# Altium project node24.PrjPcb (part 4 of 5)

## Sheet node24-bank.SchDoc: Output Channel
size Tabloid; Author: Emergence Team; Engineer: asheem; Organization: Emergence; Address1: Oakland, California; Address2: a@aliengeometry.com; Address3: Black Rock City '18; Address4: OPEN SOURCE H/W; DocumentNumber: 3; Revision: Rev 0.1; SheetNumber: 3; SheetTotal: 6; Project: NODE24
Used 3 times, as channels U_BANK-A, U_BANK-B, U_BANK-C. Parts and nets are listed once, with the designators drawn on the sheet.
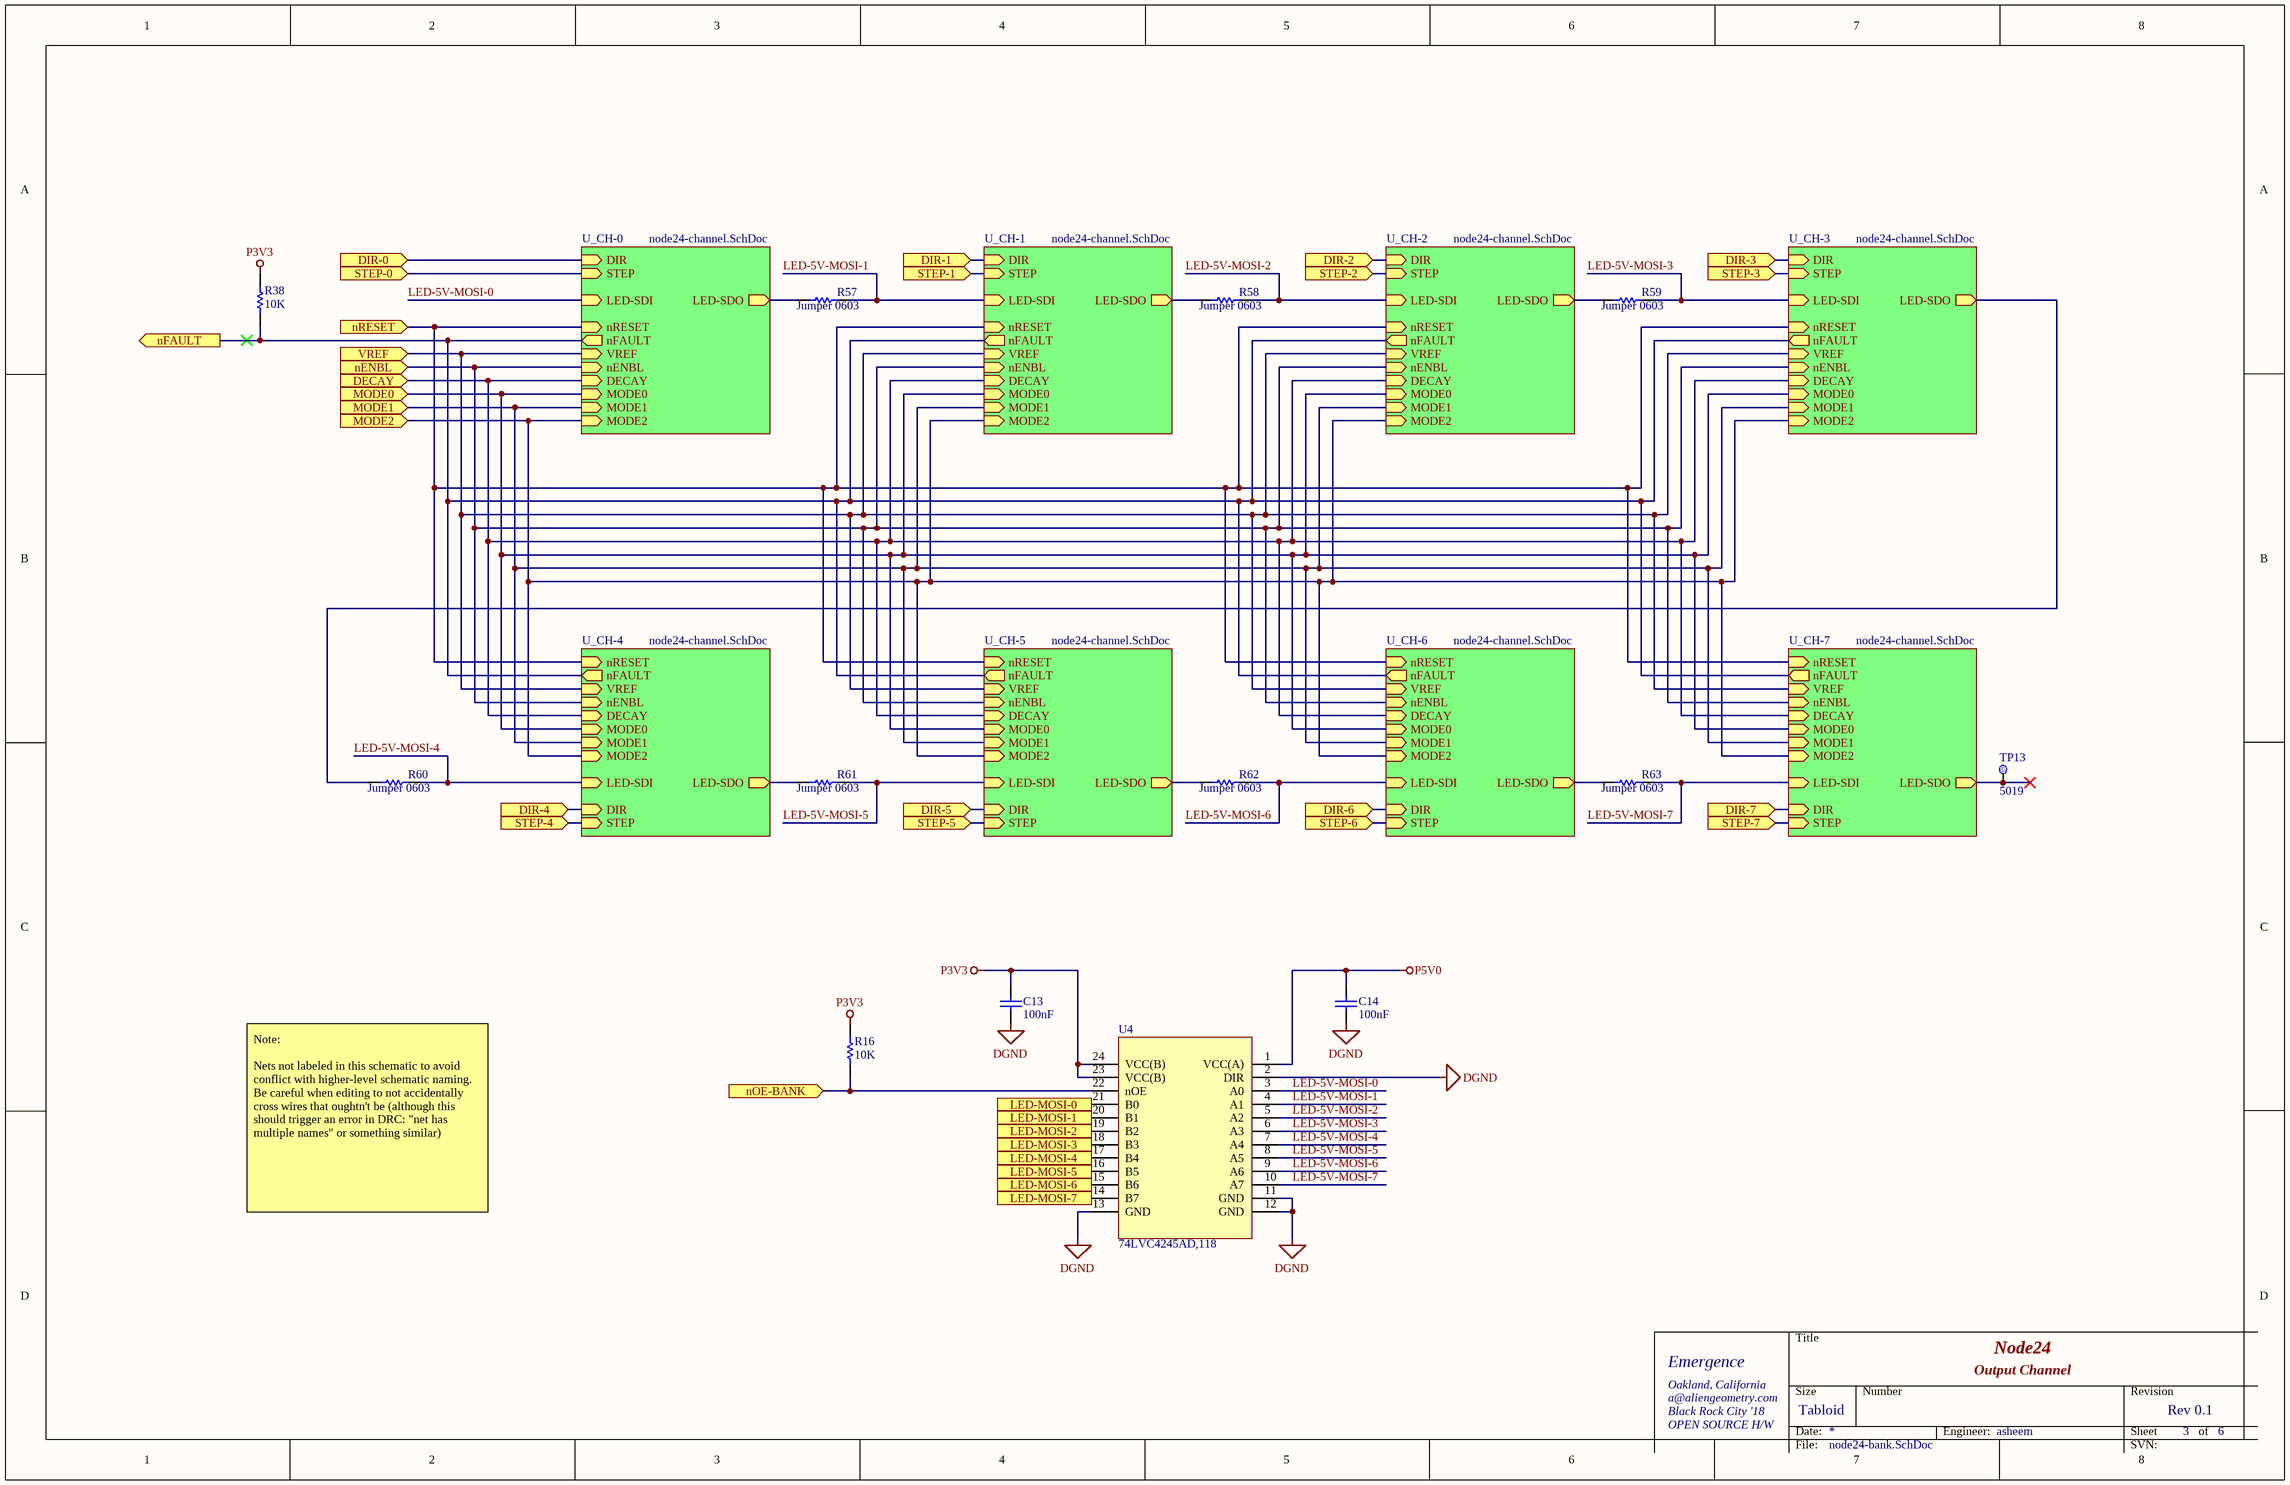
[diagram p4: node24-bank.SchDoc]

### Parts
C13  100nF  [CAPC0603(1608)100_L]
C14  100nF  [CAPC0603(1608)100_L]
R16  10K  [RESC0603(1608)_L]
R38  10K  [RESC0603(1608)_L]
R57  Jumper 0603  [RESC0603(1608)_L]
R58  Jumper 0603  [RESC0603(1608)_L]
R59  Jumper 0603  [RESC0603(1608)_L]
R60  Jumper 0603  [RESC0603(1608)_L]
R61  Jumper 0603  [RESC0603(1608)_L]
R62  Jumper 0603  [RESC0603(1608)_L]
R63  Jumper 0603  [RESC0603(1608)_L]
TP13  Manufacturer Part Number: 5019  [TEST_POINT_KEYSTONE_5019]  (hidden comment: TEST_POINT_KEYSTONE_5019_SMT)
U4  74LVC4245AD,118  [IC_TSSOP-24]

### Sub-sheets
U_CH-0 = node24-channel.SchDoc: VREF (in), nENBL (in), STEP (in), DIR (in), DECAY (in), MODE0 (in), MODE1 (in), MODE2 (in), nRESET (in), nFAULT (out), LED-SDI (in), LED-SDO (out)
U_CH-1 = node24-channel.SchDoc: VREF (in), nENBL (in), STEP (in), DIR (in), DECAY (in), MODE0 (in), MODE1 (in), MODE2 (in), nRESET (in), nFAULT (out), LED-SDI (in), LED-SDO (out)
U_CH-2 = node24-channel.SchDoc: VREF (in), nENBL (in), STEP (in), DIR (in), DECAY (in), MODE0 (in), MODE1 (in), MODE2 (in), nRESET (in), nFAULT (out), LED-SDI (in), LED-SDO (out)
U_CH-3 = node24-channel.SchDoc: VREF (in), nENBL (in), STEP (in), DIR (in), DECAY (in), MODE0 (in), MODE1 (in), MODE2 (in), nRESET (in), nFAULT (out), LED-SDI (in), LED-SDO (out)
U_CH-4 = node24-channel.SchDoc: VREF (in), nENBL (in), STEP (in), DIR (in), DECAY (in), MODE0 (in), MODE1 (in), MODE2 (in), nRESET (in), LED-SDI (in), LED-SDO (out), nFAULT (out)
U_CH-5 = node24-channel.SchDoc: VREF (in), nENBL (in), STEP (in), DIR (in), DECAY (in), MODE0 (in), MODE1 (in), MODE2 (in), nRESET (in), LED-SDI (in), LED-SDO (out), nFAULT (out)
U_CH-6 = node24-channel.SchDoc: VREF (in), nENBL (in), STEP (in), DIR (in), DECAY (in), MODE0 (in), MODE1 (in), MODE2 (in), nRESET (in), LED-SDI (in), LED-SDO (out), nFAULT (out)
U_CH-7 = node24-channel.SchDoc: VREF (in), nENBL (in), STEP (in), DIR (in), DECAY (in), MODE0 (in), MODE1 (in), MODE2 (in), nRESET (in), LED-SDI (in), LED-SDO (out), nFAULT (out)

### Ports
DECAY (in), DIR-0 (in), DIR-1 (in), DIR-2 (in), DIR-3 (in), DIR-4 (in), DIR-5 (in), DIR-6 (in), DIR-7 (in), LED-MOSI-0 (in), LED-MOSI-1 (in), LED-MOSI-2 (in), LED-MOSI-3 (in), LED-MOSI-4 (in), LED-MOSI-5 (in), LED-MOSI-6 (in), LED-MOSI-7 (in), MODE0 (in), MODE1 (in), MODE2 (in), nENBL (in), nFAULT (out), nOE-BANK (in), nRESET (in), STEP-0 (in), STEP-1 (in), STEP-2 (in), STEP-3 (in), STEP-4 (in), STEP-5 (in), STEP-6 (in), STEP-7 (in), VREF (in)

### Nets
DGND: C13.2 C14.2 U4.2(DIR) U4.11(GND) U4.12(GND) U4.13(GND)
P3V3: C13.1 R16.2 R38.2 U4.23(VCC(B)) U4.24(VCC(B))
P5V0: C14.1 U4.1(VCC(A))
DECAY: port DECAY, sheet U_CH-0/DECAY, sheet U_CH-4/DECAY, sheet U_CH-1/DECAY, sheet U_CH-5/DECAY, sheet U_CH-2/DECAY, sheet U_CH-6/DECAY, sheet U_CH-3/DECAY, sheet U_CH-7/DECAY
DIR-0: port DIR-0, sheet U_CH-0/DIR
DIR-1: port DIR-1, sheet U_CH-1/DIR
DIR-2: port DIR-2, sheet U_CH-2/DIR
DIR-3: port DIR-3, sheet U_CH-3/DIR
DIR-4: port DIR-4, sheet U_CH-4/DIR
DIR-5: port DIR-5, sheet U_CH-5/DIR
DIR-6: port DIR-6, sheet U_CH-6/DIR
DIR-7: port DIR-7, sheet U_CH-7/DIR
LED-5V-MOSI-0: U4.3(A0) ; sheet U_CH-0/LED-SDI
LED-5V-MOSI-1: R57.2 U4.4(A1) ; sheet U_CH-1/LED-SDI
LED-5V-MOSI-2: R58.2 U4.5(A2) ; sheet U_CH-2/LED-SDI
LED-5V-MOSI-3: R59.2 U4.6(A3) ; sheet U_CH-3/LED-SDI
LED-5V-MOSI-4: R60.2 U4.7(A4) ; sheet U_CH-4/LED-SDI
LED-5V-MOSI-5: R61.2 U4.8(A5) ; sheet U_CH-5/LED-SDI
LED-5V-MOSI-6: R62.2 U4.9(A6) ; sheet U_CH-6/LED-SDI
LED-5V-MOSI-7: R63.2 U4.10(A7) ; sheet U_CH-7/LED-SDI
LED-MOSI-0: U4.21(B0) ; port LED-MOSI-0
LED-MOSI-1: U4.20(B1) ; port LED-MOSI-1
LED-MOSI-2: U4.19(B2) ; port LED-MOSI-2
LED-MOSI-3: U4.18(B3) ; port LED-MOSI-3
LED-MOSI-4: U4.17(B4) ; port LED-MOSI-4
LED-MOSI-5: U4.16(B5) ; port LED-MOSI-5
LED-MOSI-6: U4.15(B6) ; port LED-MOSI-6
LED-MOSI-7: U4.14(B7) ; port LED-MOSI-7
MODE0: port MODE0, sheet U_CH-0/MODE0, sheet U_CH-4/MODE0, sheet U_CH-1/MODE0, sheet U_CH-5/MODE0, sheet U_CH-2/MODE0, sheet U_CH-6/MODE0, sheet U_CH-3/MODE0, sheet U_CH-7/MODE0
MODE1: port MODE1, sheet U_CH-0/MODE1, sheet U_CH-4/MODE1, sheet U_CH-1/MODE1, sheet U_CH-5/MODE1, sheet U_CH-2/MODE1, sheet U_CH-6/MODE1, sheet U_CH-3/MODE1, sheet U_CH-7/MODE1
MODE2: port MODE2, sheet U_CH-0/MODE2, sheet U_CH-4/MODE2, sheet U_CH-1/MODE2, sheet U_CH-5/MODE2, sheet U_CH-2/MODE2, sheet U_CH-6/MODE2, sheet U_CH-3/MODE2, sheet U_CH-7/MODE2
nENBL: port nENBL, sheet U_CH-0/nENBL, sheet U_CH-4/nENBL, sheet U_CH-1/nENBL, sheet U_CH-5/nENBL, sheet U_CH-2/nENBL, sheet U_CH-6/nENBL, sheet U_CH-3/nENBL, sheet U_CH-7/nENBL
nFAULT: R38.1 ; port nFAULT, sheet U_CH-0/nFAULT, sheet U_CH-4/nFAULT, sheet U_CH-1/nFAULT, sheet U_CH-5/nFAULT, sheet U_CH-2/nFAULT, sheet U_CH-6/nFAULT, sheet U_CH-3/nFAULT, sheet U_CH-7/nFAULT
nOE-BANK: R16.1 U4.22(nOE) ; port nOE-BANK
nRESET: port nRESET, sheet U_CH-0/nRESET, sheet U_CH-4/nRESET, sheet U_CH-1/nRESET, sheet U_CH-5/nRESET, sheet U_CH-2/nRESET, sheet U_CH-6/nRESET, sheet U_CH-3/nRESET, sheet U_CH-7/nRESET
STEP-0: port STEP-0, sheet U_CH-0/STEP
STEP-1: port STEP-1, sheet U_CH-1/STEP
STEP-2: port STEP-2, sheet U_CH-2/STEP
STEP-3: port STEP-3, sheet U_CH-3/STEP
STEP-4: port STEP-4, sheet U_CH-4/STEP
STEP-5: port STEP-5, sheet U_CH-5/STEP
STEP-6: port STEP-6, sheet U_CH-6/STEP
STEP-7: port STEP-7, sheet U_CH-7/STEP
VREF: port VREF, sheet U_CH-0/VREF, sheet U_CH-4/VREF, sheet U_CH-1/VREF, sheet U_CH-5/VREF, sheet U_CH-2/VREF, sheet U_CH-6/VREF, sheet U_CH-3/VREF, sheet U_CH-7/VREF
NetR57_1: R57.1 ; sheet U_CH-0/LED-SDO
NetR58_1: R58.1 ; sheet U_CH-1/LED-SDO
NetR59_1: R59.1 ; sheet U_CH-2/LED-SDO
NetR60_1: R60.1 ; sheet U_CH-3/LED-SDO
NetR61_1: R61.1 ; sheet U_CH-4/LED-SDO
NetR62_1: R62.1 ; sheet U_CH-5/LED-SDO
NetR63_1: R63.1 ; sheet U_CH-6/LED-SDO
NetTP13_1: TP13.1 ; sheet U_CH-7/LED-SDO

### Channels
U_BANK-A: designators end in A; ports DECAY=DRV-BANKA-DECAY DIR-0=DRV-BANKA-DIR-0 DIR-1=DRV-BANKA-DIR-1 DIR-2=DRV-BANKA-DIR-2 DIR-3=DRV-BANKA-DIR-3 DIR-4=DRV-BANKA-DIR-4 DIR-5=DRV-BANKA-DIR-5 DIR-6=DRV-BANKA-DIR-6 DIR-7=DRV-BANKA-DIR-7 LED-MOSI-0=LED-BANKA-MOSI-0 LED-MOSI-1=LED-BANKA-MOSI-1 LED-MOSI-2=LED-BANKA-MOSI-2 LED-MOSI-3=LED-BANKA-MOSI-3 LED-MOSI-4=LED-BANKA-MOSI-4 LED-MOSI-5=LED-BANKA-MOSI-5 LED-MOSI-6=LED-BANKA-MOSI-6 LED-MOSI-7=LED-BANKA-MOSI-7 MODE0=DRV-BANKA-MODE0 MODE1=DRV-BANKA-MODE1 MODE2=DRV-BANKA-MODE2 nENBL=DRV-BANKA-nENBL nFAULT=DRV-BANKA-nFAULT nOE-BANK=LED-BANKA-nOE nRESET=DRV-BANKA-nRESET STEP-0=DRV-BANKA-STEP-0 STEP-1=DRV-BANKA-STEP-1 STEP-2=DRV-BANKA-STEP-2 STEP-3=DRV-BANKA-STEP-3 STEP-4=DRV-BANKA-STEP-4 STEP-5=DRV-BANKA-STEP-5 STEP-6=DRV-BANKA-STEP-6 STEP-7=DRV-BANKA-STEP-7 VREF=DRV-BANKA-VREF
U_BANK-B: designators end in B; ports DECAY=DRV-BANKB-DECAY DIR-0=DRV-BANKB-DIR-0 DIR-1=DRV-BANKB-DIR-1 DIR-2=DRV-BANKB-DIR-2 DIR-3=DRV-BANKB-DIR-3 DIR-4=DRV-BANKB-DIR-4 DIR-5=DRV-BANKB-DIR-5 DIR-6=DRV-BANKB-DIR-6 DIR-7=DRV-BANKB-DIR-7 LED-MOSI-0=LED-BANKB-MOSI-0 LED-MOSI-1=LED-BANKB-MOSI-1 LED-MOSI-2=LED-BANKB-MOSI-2 LED-MOSI-3=LED-BANKB-MOSI-3 LED-MOSI-4=LED-BANKB-MOSI-4 LED-MOSI-5=LED-BANKB-MOSI-5 LED-MOSI-6=LED-BANKB-MOSI-6 LED-MOSI-7=LED-BANKB-MOSI-7 MODE0=DRV-BANKB-MODE0 MODE1=DRV-BANKB-MODE1 MODE2=DRV-BANKB-MODE2 nENBL=DRV-BANKB-nENBL nFAULT=DRV-BANKB-nFAULT nOE-BANK=LED-BANKB-nOE nRESET=DRV-BANKB-nRESET STEP-0=DRV-BANKB-STEP-0 STEP-1=DRV-BANKB-STEP-1 STEP-2=DRV-BANKB-STEP-2 STEP-3=DRV-BANKB-STEP-3 STEP-4=DRV-BANKB-STEP-4 STEP-5=DRV-BANKB-STEP-5 STEP-6=DRV-BANKB-STEP-6 STEP-7=DRV-BANKB-STEP-7 VREF=DRV-BANKB-VREF
U_BANK-C: designators end in C; ports DECAY=DRV-BANKC-DECAY DIR-0=DRV-BANKC-DIR-0 DIR-1=DRV-BANKC-DIR-1 DIR-2=DRV-BANKC-DIR-2 DIR-3=DRV-BANKC-DIR-3 DIR-4=DRV-BANKC-DIR-4 DIR-5=DRV-BANKC-DIR-5 DIR-6=DRV-BANKC-DIR-6 DIR-7=DRV-BANKC-DIR-7 LED-MOSI-0=LED-BANKC-MOSI-0 LED-MOSI-1=LED-BANKC-MOSI-1 LED-MOSI-2=LED-BANKC-MOSI-2 LED-MOSI-3=LED-BANKC-MOSI-3 LED-MOSI-4=LED-BANKC-MOSI-4 LED-MOSI-5=LED-BANKC-MOSI-5 LED-MOSI-6=LED-BANKC-MOSI-6 LED-MOSI-7=LED-BANKC-MOSI-7 MODE0=DRV-BANKC-MODE0 MODE1=DRV-BANKC-MODE1 MODE2=DRV-BANKC-MODE2 nENBL=DRV-BANKC-nENBL nFAULT=DRV-BANKC-nFAULT nOE-BANK=LED-BANKC-nOE nRESET=DRV-BANKC-nRESET STEP-0=DRV-BANKC-STEP-0 STEP-1=DRV-BANKC-STEP-1 STEP-2=DRV-BANKC-STEP-2 STEP-3=DRV-BANKC-STEP-3 STEP-4=DRV-BANKC-STEP-4 STEP-5=DRV-BANKC-STEP-5 STEP-6=DRV-BANKC-STEP-6 STEP-7=DRV-BANKC-STEP-7 VREF=DRV-BANKC-VREF

### Notes on the sheet
- Note:
  Nets not labeled in this schematic to avoid conflict with higher-level schematic naming. Be careful when editing to not accidentally cross wires that oughtn't be (although this should trigger an error in DRC: "net has multiple names" or something similar)
- Title
- Size
- Date:
- Tabloid
- Number
- Engineer:
- Revision
- Sheet
- of
- File:
- SVN:

### Library data of the parts
C13 C14 = CMP-1035-02593-1: CAP 100nF 50V ±20% 0603 (1608 Metric) Thickness 1mm SMD; Tolerance: Â±20%; Case-EIA: 0603; Case-Metric: 1608; Max Thickness: 1 mm; Value: 100nF; Technology: SMT; Rated Voltage: 50 V
R16 R38 = CMP-1012-00623-1: 10K 0.1W 1% 0603 (1608 Metric)  SMD; Value: 10000.00 Ohm; Case-EIA: 0603; Case-Metric: 1608; Power: 0.1 W; Tolerance: 1 %; Technology: SMT
R57-R63 = CMP-1012-00001-1: Jumper 0603 (1608 Metric); Case-Metric: 1608; Value: 0.00 Ohm; Power: None; Case-EIA: 0603; Technology: SMT; Tolerance: None
TP13 = TEST_POINT_KEYSTONE_5019_SMT: Circuit Board Hardware - PCB TEST POINT; Manufacturer: Keystone Electronics; Supplier 1: Digi-Key; Stock 1: 207442; Pricing 1: 1=0.38, 10=0.355, 25=0.3044, 50=0.2586, 100=0.2485, 250=0.22316, 500=0.21302 (USD); Mount: Surface Mount,PCB; Number of Pins: 1; Contact Plating: Silver; Material: Bronze; Contact Material: Bronze; Packaging: Tape and Reel; Package Quantity: 1; Termination: SMD/SMT; Height: 0.09inch; REACH SVHC: No SVHC; Lead Free: Lead Free; ComponentLink1URL: https://datasheet.ciiva.com/14848/m60-2p61-14848437.pdf; ComponentLink1Description: https://datasheet.ciiva.com/14848/m60-2p61-14848437.pdf; ComponentLink2URL: https://datasheet.ciiva.com/14848/m60-2p61-14848438.pdf; ComponentLink2Description: https://datasheet.ciiva.com/14848/m60-2p61-14848438.pdf; ComponentLink3URL: https://datasheet.ciiva.com/14848/m60-2p61-14848439.pdf; ComponentLink3Description: https://datasheet.ciiva.com/14848/m60-2p61-14848439.pdf; ComponentLink4URL: https://datasheet.ciiva.com/16885/70182998-16885945.pdf; ComponentLink4Description: https://datasheet.ciiva.com/16885/70182998-16885945.pdf; ComponentLink5URL: https://datasheet.ciiva.com/16318/m60-2p61-16318395.pdf; ComponentLink5Description: https://datasheet.ciiva.com/16318/m60-2p61-16318395.pdf; Supplier Part Number 1: 36-5019CT-ND
U4 = 74LVC4245AD,118: IC TRANSCVR TRI-ST DL 24SOIC; Manufacturer: NXP Semiconductors; Number of Channels: 8; Propagation Delay: 8ns; Min Supply Voltage: 1.5V; Max Supply Voltage: 5.5V; Number of Elements: 1; Direction: Bidirectional; Logic Function: Transceiver,Translator; Low Level Output Current: 24mA; Turn-On Delay Time: 3.6ns; Polarity: Non-Inverting; High Level Output Current: -24mA; Quiescent Current: 100nA; Output Type: TTL; Supplier 1: Digi-Key; Stock 1: 3472; Pricing 1: 1=0.63, 10=0.558, 100=0.4277, 500=0.3381 (USD); Mount: Surface Mount; Case/Package: SO; Number of Pins: 24; Contact Plating: Gold; Min Operating Temperature: -40°C; Max Operating Temperature: 125°C; Package Quantity: 1000; Packaging: Tape and Reel; Number of Bits: 8; Number of Circuits: 1; Radiation Hardening: No; REACH SVHC: No SVHC; Lead Free: Lead Free; ComponentLink1URL: https://datasheet.ciiva.com/1899/74lvc4245a-1899059.pdf; ComponentLink1Description: https://datasheet.ciiva.com/1899/74lvc4245a-1899059.pdf; ComponentLink2URL: https://datasheet.ciiva.com/1899/74lvc4245a-1899060.pdf; ComponentLink2Description: https://datasheet.ciiva.com/1899/74lvc4245a-1899060.pdf; ComponentLink3URL: https://datasheet.ciiva.com/1899/74lvc4245a-1899061.pdf; ComponentLink3Description: https://datasheet.ciiva.com/1899/74lvc4245a-1899061.pdf; ComponentLink4URL: https://datasheet.ciiva.com/8260/74lvc4245a-8260005.pdf; ComponentLink4Description: https://datasheet.ciiva.com/8260/74lvc4245a-8260005.pdf; ComponentLink5URL: https://datasheet.ciiva.com/16591/74lvc4245a-16591349.pdf; ComponentLink5Description: https://datasheet.ciiva.com/16591/74lvc4245a-16591349.pdf; ComponentLink6URL: https://datasheet.ciiva.com/46434/1714648-46434213.pdf; ComponentLink6Description: https://datasheet.ciiva.com/46434/1714648-46434213.pdf; ComponentLink7URL: https://datasheet.ciiva.com/1899/74lvc4245a-1899063.pdf; ComponentLink7Description: https://datasheet.ciiva.com/1899/74lvc4245a-1899063.pdf; Supplier Part Number 1: 1727-6369-6-ND; Manufacturer Part Number: 74LVC4245AD,118

## Sheet node24-channel.SchDoc: Output Channel
size Tabloid; Author: Emergence Team; Engineer: asheem; Organization: Emergence; Address1: Oakland, California; Address2: a@aliengeometry.com; Address3: Black Rock City '18; Address4: OPEN SOURCE H/W; DocumentNumber: 4; Revision: Rev 0.1; SheetNumber: 4; SheetTotal: 6; Project: NODE24
Used 24 times, as channels U_BANK-A/U_CH-0, U_BANK-A/U_CH-4, U_BANK-A/U_CH-1, U_BANK-A/U_CH-5, U_BANK-A/U_CH-2, U_BANK-A/U_CH-6, U_BANK-A/U_CH-3, U_BANK-A/U_CH-7, U_BANK-B/U_CH-0, U_BANK-B/U_CH-4, U_BANK-B/U_CH-1, U_BANK-B/U_CH-5, U_BANK-B/U_CH-2, U_BANK-B/U_CH-6, U_BANK-B/U_CH-3, U_BANK-B/U_CH-7, U_BANK-C/U_CH-0, U_BANK-C/U_CH-4, U_BANK-C/U_CH-1, U_BANK-C/U_CH-5, U_BANK-C/U_CH-2, U_BANK-C/U_CH-6, U_BANK-C/U_CH-3, U_BANK-C/U_CH-7. Parts and nets are listed once, with the designators drawn on the sheet.
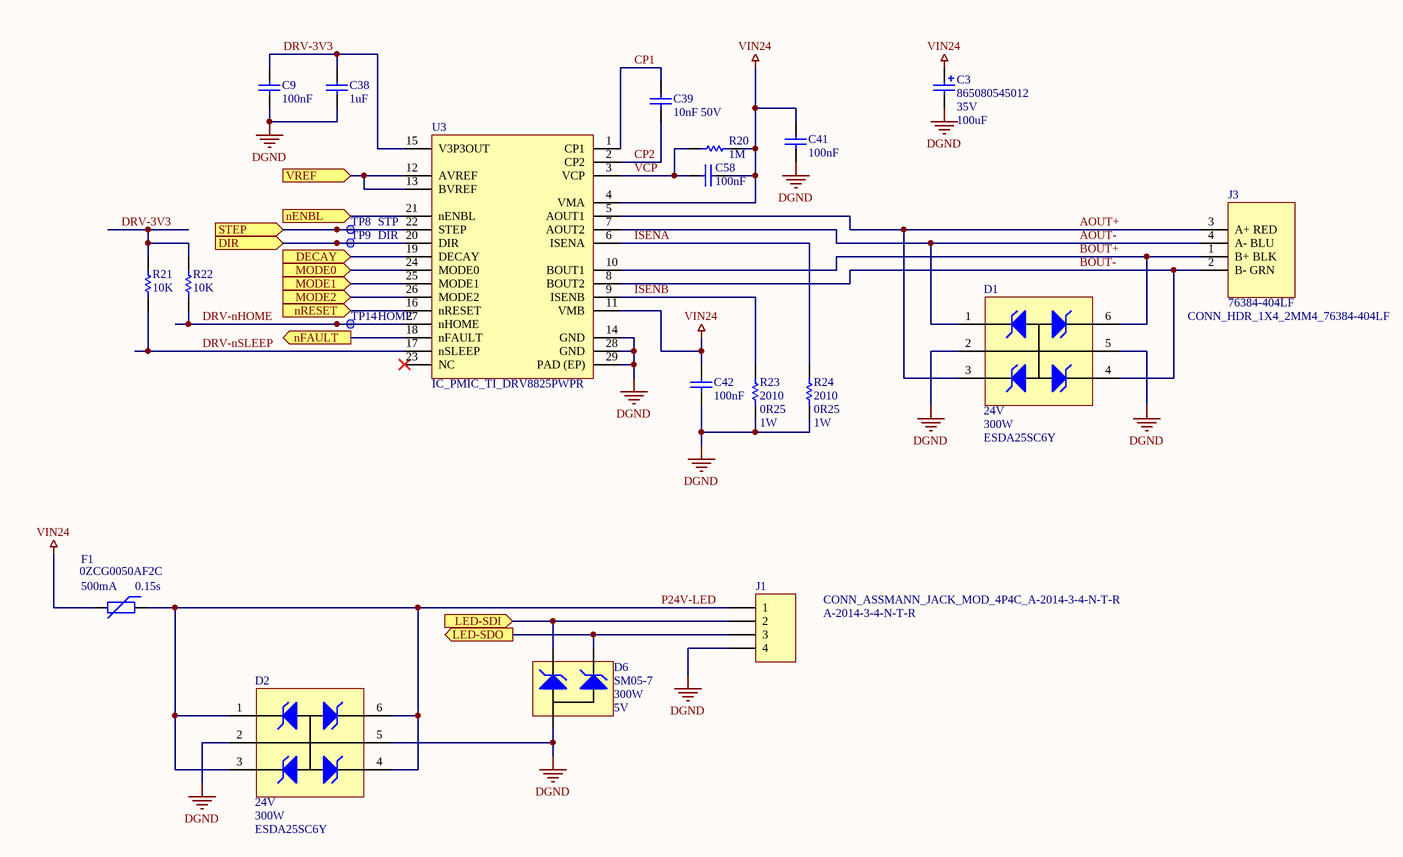
[diagram p5: node24-channel.SchDoc]

### Parts
C3  Manufacturer Part Number: 865080545012  Voltage Rating (DC): 35V  Capacitance: 100uF  [CAPAE_D6MM3]  (hidden comment: CAP_ALUM_100UF_35V_6MM3_SMT_865080545012)
C9  100nF  [CAPC0603(1608)100_L]
C38  1uF  [CAPC0603(1608)100_L]
C39  10nF 50V  [CAPC0603(1608)100_L]
C41  100nF  [CAPC0603(1608)100_L]
C42  100nF  [CAPC0603(1608)100_L]
C58  100nF  [CAPC0603(1608)100_L]
D1  Operating Supply Voltage: 24V  Peak Pulse Power: 300W  Manufacturer Part Number: ESDA25SC6Y  [SOT23-6L]  (hidden comment: TVS_24V_QUAD_300W_SOT23-6_ESDA25SC6Y)
D2  Operating Supply Voltage: 24V  Peak Pulse Power: 300W  Manufacturer Part Number: ESDA25SC6Y  [SOT23-6L]  (hidden comment: TVS_24V_QUAD_300W_SOT23-6_ESDA25SC6Y)
D6  Manufacturer Part Number: SM05-7  Max Power Dissipation: 300W  Reverse Standoff Voltage: 5V  [SOT-23]  (hidden comment: TVS_5V_DUAL_SOT23-3_SM05-7)
F1  Hold Current: 500mA  Time to Trip: 0.15s  Manufacturer Part Number: 0ZCG0050AF2C  [FUSE_1812]  (hidden comment: FUSE_BELFUSE_PTC_30V_500MA_1812_0ZCG0050AF2C)
J1  CONN_ASSMANN_JACK_MOD_4P4C_A-2014-3-4-N-T-R  Manufacturer Part Number: A-2014-3-4-N-T-R  [CON_JACK_MOD_4P4C_ASSMANN_A-2014-3-4-N-T-R]
J3  CONN_HDR_1X4_2MM4_76384-404LF  Manufacturer Part Number: 76384-404LF  [HDR_1x4_2R54_V_M]
R20  1M  [RESC0603(1608)_L]
R21  10K  [RESC0603(1608)_L]
R22  10K  [RESC0603(1608)_L]
R23  Case Code (Imperial): 2010  Resistance: 0R25  Power Rating: 1W  [RES2010N]  (hidden comment: RES_2010_0R25_1W_CSRN2010FKR250)
R24  Case Code (Imperial): 2010  Resistance: 0R25  Power Rating: 1W  [RES2010N]  (hidden comment: RES_2010_0R25_1W_CSRN2010FKR250)
TP8  STP  [TP_1MM]
TP9  DIR  [TP_1MM]
TP14  HOME  [TP_1MM]
U3  IC_PMIC_TI_DRV8825PWPR  [IC_TSSOP28_0MM65_EP52X31]

### Ports
DECAY (in), DIR (in), LED-SDI (in), LED-SDO (out), MODE0 (in), MODE1 (in), MODE2 (in), nENBL (in), nFAULT (out), nRESET (in), STEP (in), VREF (in)

### Nets
DGND: C3.2 C9.1 C38.1 C41.2 C42.2 D1.2(A1) D1.5(A2) D2.2(A1) D2.5(A2) D6.3(A) J1.4 R23.2 R24.2 U3.14(GND) U3.28(GND) U3.29(PAD_(EP))
VIN24: C3.1 C41.1 C42.1 C58.1 F1.2 R20.2 U3.4(VMA) U3.11(VMB)
AOUT+: D1.3(K2) J3.3(A+_RED) U3.5(AOUT1)
AOUT-: D1.1(K1) J3.4(A-_BLU) U3.7(AOUT2)
BOUT+: D1.6(K4) J3.1(B+_BLK) U3.10(BOUT1)
BOUT-: D1.4(K3) J3.2(B-_GRN) U3.8(BOUT2)
CP1: C39.2 U3.1(CP1)
CP2: C39.1 U3.2(CP2)
DECAY: U3.19(DECAY) ; port DECAY
DIR: TP9.1 U3.20(DIR) ; port DIR
DRV-3V3: C9.2 C38.2 R21.2 R22.2 U3.15(V3P3OUT)
DRV-nHOME: R22.1 TP14.1 U3.27(nHOME)
DRV-nSLEEP: R21.1 U3.17(nSLEEP)
ISENA: R24.1 U3.6(ISENA)
ISENB: R23.1 U3.9(ISENB)
LED-SDI: D6.1(K1) J1.2 ; port LED-SDI
LED-SDO: D6.2(K2) J1.3 ; port LED-SDO
MODE0: U3.24(MODE0) ; port MODE0
MODE1: U3.25(MODE1) ; port MODE1
MODE2: U3.26(MODE2) ; port MODE2
nENBL: U3.21(nENBL) ; port nENBL
nFAULT: U3.18(nFAULT) ; port nFAULT
nRESET: U3.16(nRESET) ; port nRESET
P24V-LED: D2.1(K1) D2.3(K2) D2.4(K3) D2.6(K4) F1.1 J1.1
STEP: TP8.1 U3.22(STEP) ; port STEP
VCP: C58.2 R20.1 U3.3(VCP)
VREF: U3.12(AVREF) U3.13(BVREF) ; port VREF

Not connected (* = marked no-connect by the designer): U3 23(NC)*

### Channels
U_BANK-A/U_CH-0: designators end in A; ports DECAY=DRV-BANKA-DECAY DIR=DRV-BANKA-DIR-0 LED-SDI=LED-5V-MOSI-0_U_BANK-A LED-SDO=NetD6A_2 MODE0=DRV-BANKA-MODE0 MODE1=DRV-BANKA-MODE1 MODE2=DRV-BANKA-MODE2 nENBL=DRV-BANKA-nENBL nFAULT=DRV-BANKA-nFAULT nRESET=DRV-BANKA-nRESET STEP=DRV-BANKA-STEP-0 VREF=DRV-BANKA-VREF
U_BANK-A/U_CH-4: designators end in B; ports DECAY=DRV-BANKA-DECAY DIR=DRV-BANKA-DIR-4 LED-SDI=LED-5V-MOSI-4_U_BANK-A LED-SDO=NetD6B_2 MODE0=DRV-BANKA-MODE0 MODE1=DRV-BANKA-MODE1 MODE2=DRV-BANKA-MODE2 nENBL=DRV-BANKA-nENBL nFAULT=DRV-BANKA-nFAULT nRESET=DRV-BANKA-nRESET STEP=DRV-BANKA-STEP-4 VREF=DRV-BANKA-VREF
U_BANK-A/U_CH-1: designators end in C; ports DECAY=DRV-BANKA-DECAY DIR=DRV-BANKA-DIR-1 LED-SDI=LED-5V-MOSI-1_U_BANK-A LED-SDO=NetD6C_2 MODE0=DRV-BANKA-MODE0 MODE1=DRV-BANKA-MODE1 MODE2=DRV-BANKA-MODE2 nENBL=DRV-BANKA-nENBL nFAULT=DRV-BANKA-nFAULT nRESET=DRV-BANKA-nRESET STEP=DRV-BANKA-STEP-1 VREF=DRV-BANKA-VREF
U_BANK-A/U_CH-5: designators end in D; ports DECAY=DRV-BANKA-DECAY DIR=DRV-BANKA-DIR-5 LED-SDI=LED-5V-MOSI-5_U_BANK-A LED-SDO=NetD6D_2 MODE0=DRV-BANKA-MODE0 MODE1=DRV-BANKA-MODE1 MODE2=DRV-BANKA-MODE2 nENBL=DRV-BANKA-nENBL nFAULT=DRV-BANKA-nFAULT nRESET=DRV-BANKA-nRESET STEP=DRV-BANKA-STEP-5 VREF=DRV-BANKA-VREF
U_BANK-A/U_CH-2: designators end in E; ports DECAY=DRV-BANKA-DECAY DIR=DRV-BANKA-DIR-2 LED-SDI=LED-5V-MOSI-2_U_BANK-A LED-SDO=NetD6E_2 MODE0=DRV-BANKA-MODE0 MODE1=DRV-BANKA-MODE1 MODE2=DRV-BANKA-MODE2 nENBL=DRV-BANKA-nENBL nFAULT=DRV-BANKA-nFAULT nRESET=DRV-BANKA-nRESET STEP=DRV-BANKA-STEP-2 VREF=DRV-BANKA-VREF
U_BANK-A/U_CH-6: designators end in F; ports DECAY=DRV-BANKA-DECAY DIR=DRV-BANKA-DIR-6 LED-SDI=LED-5V-MOSI-6_U_BANK-A LED-SDO=NetD6F_2 MODE0=DRV-BANKA-MODE0 MODE1=DRV-BANKA-MODE1 MODE2=DRV-BANKA-MODE2 nENBL=DRV-BANKA-nENBL nFAULT=DRV-BANKA-nFAULT nRESET=DRV-BANKA-nRESET STEP=DRV-BANKA-STEP-6 VREF=DRV-BANKA-VREF
U_BANK-A/U_CH-3: designators end in G; ports DECAY=DRV-BANKA-DECAY DIR=DRV-BANKA-DIR-3 LED-SDI=LED-5V-MOSI-3_U_BANK-A LED-SDO=NetD6G_2 MODE0=DRV-BANKA-MODE0 MODE1=DRV-BANKA-MODE1 MODE2=DRV-BANKA-MODE2 nENBL=DRV-BANKA-nENBL nFAULT=DRV-BANKA-nFAULT nRESET=DRV-BANKA-nRESET STEP=DRV-BANKA-STEP-3 VREF=DRV-BANKA-VREF
U_BANK-A/U_CH-7: designators end in H; ports DECAY=DRV-BANKA-DECAY DIR=DRV-BANKA-DIR-7 LED-SDI=LED-5V-MOSI-7_U_BANK-A LED-SDO=NetD6H_2 MODE0=DRV-BANKA-MODE0 MODE1=DRV-BANKA-MODE1 MODE2=DRV-BANKA-MODE2 nENBL=DRV-BANKA-nENBL nFAULT=DRV-BANKA-nFAULT nRESET=DRV-BANKA-nRESET STEP=DRV-BANKA-STEP-7 VREF=DRV-BANKA-VREF
U_BANK-B/U_CH-0: designators end in I; ports DECAY=DRV-BANKB-DECAY DIR=DRV-BANKB-DIR-0 LED-SDI=LED-5V-MOSI-0_U_BANK-B LED-SDO=NetD6I_2 MODE0=DRV-BANKB-MODE0 MODE1=DRV-BANKB-MODE1 MODE2=DRV-BANKB-MODE2 nENBL=DRV-BANKB-nENBL nFAULT=DRV-BANKB-nFAULT nRESET=DRV-BANKB-nRESET STEP=DRV-BANKB-STEP-0 VREF=DRV-BANKB-VREF
U_BANK-B/U_CH-4: designators end in J; ports DECAY=DRV-BANKB-DECAY DIR=DRV-BANKB-DIR-4 LED-SDI=LED-5V-MOSI-4_U_BANK-B LED-SDO=NetD6J_2 MODE0=DRV-BANKB-MODE0 MODE1=DRV-BANKB-MODE1 MODE2=DRV-BANKB-MODE2 nENBL=DRV-BANKB-nENBL nFAULT=DRV-BANKB-nFAULT nRESET=DRV-BANKB-nRESET STEP=DRV-BANKB-STEP-4 VREF=DRV-BANKB-VREF
U_BANK-B/U_CH-1: designators end in K; ports DECAY=DRV-BANKB-DECAY DIR=DRV-BANKB-DIR-1 LED-SDI=LED-5V-MOSI-1_U_BANK-B LED-SDO=NetD6K_2 MODE0=DRV-BANKB-MODE0 MODE1=DRV-BANKB-MODE1 MODE2=DRV-BANKB-MODE2 nENBL=DRV-BANKB-nENBL nFAULT=DRV-BANKB-nFAULT nRESET=DRV-BANKB-nRESET STEP=DRV-BANKB-STEP-1 VREF=DRV-BANKB-VREF
U_BANK-B/U_CH-5: designators end in L; ports DECAY=DRV-BANKB-DECAY DIR=DRV-BANKB-DIR-5 LED-SDI=LED-5V-MOSI-5_U_BANK-B LED-SDO=NetD6L_2 MODE0=DRV-BANKB-MODE0 MODE1=DRV-BANKB-MODE1 MODE2=DRV-BANKB-MODE2 nENBL=DRV-BANKB-nENBL nFAULT=DRV-BANKB-nFAULT nRESET=DRV-BANKB-nRESET STEP=DRV-BANKB-STEP-5 VREF=DRV-BANKB-VREF
U_BANK-B/U_CH-2: designators end in M; ports DECAY=DRV-BANKB-DECAY DIR=DRV-BANKB-DIR-2 LED-SDI=LED-5V-MOSI-2_U_BANK-B LED-SDO=NetD6M_2 MODE0=DRV-BANKB-MODE0 MODE1=DRV-BANKB-MODE1 MODE2=DRV-BANKB-MODE2 nENBL=DRV-BANKB-nENBL nFAULT=DRV-BANKB-nFAULT nRESET=DRV-BANKB-nRESET STEP=DRV-BANKB-STEP-2 VREF=DRV-BANKB-VREF
U_BANK-B/U_CH-6: designators end in N; ports DECAY=DRV-BANKB-DECAY DIR=DRV-BANKB-DIR-6 LED-SDI=LED-5V-MOSI-6_U_BANK-B LED-SDO=NetD6N_2 MODE0=DRV-BANKB-MODE0 MODE1=DRV-BANKB-MODE1 MODE2=DRV-BANKB-MODE2 nENBL=DRV-BANKB-nENBL nFAULT=DRV-BANKB-nFAULT nRESET=DRV-BANKB-nRESET STEP=DRV-BANKB-STEP-6 VREF=DRV-BANKB-VREF
U_BANK-B/U_CH-3: designators end in O; ports DECAY=DRV-BANKB-DECAY DIR=DRV-BANKB-DIR-3 LED-SDI=LED-5V-MOSI-3_U_BANK-B LED-SDO=NetD6O_2 MODE0=DRV-BANKB-MODE0 MODE1=DRV-BANKB-MODE1 MODE2=DRV-BANKB-MODE2 nENBL=DRV-BANKB-nENBL nFAULT=DRV-BANKB-nFAULT nRESET=DRV-BANKB-nRESET STEP=DRV-BANKB-STEP-3 VREF=DRV-BANKB-VREF
U_BANK-B/U_CH-7: designators end in P; ports DECAY=DRV-BANKB-DECAY DIR=DRV-BANKB-DIR-7 LED-SDI=LED-5V-MOSI-7_U_BANK-B LED-SDO=NetD6P_2 MODE0=DRV-BANKB-MODE0 MODE1=DRV-BANKB-MODE1 MODE2=DRV-BANKB-MODE2 nENBL=DRV-BANKB-nENBL nFAULT=DRV-BANKB-nFAULT nRESET=DRV-BANKB-nRESET STEP=DRV-BANKB-STEP-7 VREF=DRV-BANKB-VREF
U_BANK-C/U_CH-0: designators end in Q; ports DECAY=DRV-BANKC-DECAY DIR=DRV-BANKC-DIR-0 LED-SDI=LED-5V-MOSI-0_U_BANK-C LED-SDO=NetD6Q_2 MODE0=DRV-BANKC-MODE0 MODE1=DRV-BANKC-MODE1 MODE2=DRV-BANKC-MODE2 nENBL=DRV-BANKC-nENBL nFAULT=DRV-BANKC-nFAULT nRESET=DRV-BANKC-nRESET STEP=DRV-BANKC-STEP-0 VREF=DRV-BANKC-VREF
U_BANK-C/U_CH-4: designators end in R; ports DECAY=DRV-BANKC-DECAY DIR=DRV-BANKC-DIR-4 LED-SDI=LED-5V-MOSI-4_U_BANK-C LED-SDO=NetD6R_2 MODE0=DRV-BANKC-MODE0 MODE1=DRV-BANKC-MODE1 MODE2=DRV-BANKC-MODE2 nENBL=DRV-BANKC-nENBL nFAULT=DRV-BANKC-nFAULT nRESET=DRV-BANKC-nRESET STEP=DRV-BANKC-STEP-4 VREF=DRV-BANKC-VREF
U_BANK-C/U_CH-1: designators end in S; ports DECAY=DRV-BANKC-DECAY DIR=DRV-BANKC-DIR-1 LED-SDI=LED-5V-MOSI-1_U_BANK-C LED-SDO=NetD6S_2 MODE0=DRV-BANKC-MODE0 MODE1=DRV-BANKC-MODE1 MODE2=DRV-BANKC-MODE2 nENBL=DRV-BANKC-nENBL nFAULT=DRV-BANKC-nFAULT nRESET=DRV-BANKC-nRESET STEP=DRV-BANKC-STEP-1 VREF=DRV-BANKC-VREF
U_BANK-C/U_CH-5: designators end in T; ports DECAY=DRV-BANKC-DECAY DIR=DRV-BANKC-DIR-5 LED-SDI=LED-5V-MOSI-5_U_BANK-C LED-SDO=NetD6T_2 MODE0=DRV-BANKC-MODE0 MODE1=DRV-BANKC-MODE1 MODE2=DRV-BANKC-MODE2 nENBL=DRV-BANKC-nENBL nFAULT=DRV-BANKC-nFAULT nRESET=DRV-BANKC-nRESET STEP=DRV-BANKC-STEP-5 VREF=DRV-BANKC-VREF
U_BANK-C/U_CH-2: designators end in U; ports DECAY=DRV-BANKC-DECAY DIR=DRV-BANKC-DIR-2 LED-SDI=LED-5V-MOSI-2_U_BANK-C LED-SDO=NetD6U_2 MODE0=DRV-BANKC-MODE0 MODE1=DRV-BANKC-MODE1 MODE2=DRV-BANKC-MODE2 nENBL=DRV-BANKC-nENBL nFAULT=DRV-BANKC-nFAULT nRESET=DRV-BANKC-nRESET STEP=DRV-BANKC-STEP-2 VREF=DRV-BANKC-VREF
U_BANK-C/U_CH-6: designators end in V; ports DECAY=DRV-BANKC-DECAY DIR=DRV-BANKC-DIR-6 LED-SDI=LED-5V-MOSI-6_U_BANK-C LED-SDO=NetD6V_2 MODE0=DRV-BANKC-MODE0 MODE1=DRV-BANKC-MODE1 MODE2=DRV-BANKC-MODE2 nENBL=DRV-BANKC-nENBL nFAULT=DRV-BANKC-nFAULT nRESET=DRV-BANKC-nRESET STEP=DRV-BANKC-STEP-6 VREF=DRV-BANKC-VREF
U_BANK-C/U_CH-3: designators end in W; ports DECAY=DRV-BANKC-DECAY DIR=DRV-BANKC-DIR-3 LED-SDI=LED-5V-MOSI-3_U_BANK-C LED-SDO=NetD6W_2 MODE0=DRV-BANKC-MODE0 MODE1=DRV-BANKC-MODE1 MODE2=DRV-BANKC-MODE2 nENBL=DRV-BANKC-nENBL nFAULT=DRV-BANKC-nFAULT nRESET=DRV-BANKC-nRESET STEP=DRV-BANKC-STEP-3 VREF=DRV-BANKC-VREF
U_BANK-C/U_CH-7: designators end in X; ports DECAY=DRV-BANKC-DECAY DIR=DRV-BANKC-DIR-7 LED-SDI=LED-5V-MOSI-7_U_BANK-C LED-SDO=NetD6X_2 MODE0=DRV-BANKC-MODE0 MODE1=DRV-BANKC-MODE1 MODE2=DRV-BANKC-MODE2 nENBL=DRV-BANKC-nENBL nFAULT=DRV-BANKC-nFAULT nRESET=DRV-BANKC-nRESET STEP=DRV-BANKC-STEP-7 VREF=DRV-BANKC-VREF

### Notes on the sheet
- Title
- Size
- Date:
- Tabloid
- Number
- Engineer:
- Revision
- Sheet
- of
- File:
- SVN:

### Library data of the parts
C3 = CAP_ALUM_100UF_35V_6MM3_SMT_865080545012: WURTH ELEKTRONIK         865080545012             SMD Aluminium Electrolytic Capacitor, Radial Can - SMD, 100 F, 35 V, WCAP-ASLI Series; Manufacturer: Wurth Electronics; Life (Hours): 2000Hour; Ripple Current (AC): 300mA; Supplier 1: Digi-Key; Stock 1: 5637; Pricing 1: 1=0.33, 50=0.278, 100=0.242, 250=0.215 (USD); Case/Package: Radial; Min Operating Temperature: -55°C; Max Operating Temperature: 105°C; Voltage Rating: 35V; Packaging: Cut Tape; Diameter: 6.3mm; Height: 7.7mm; REACH SVHC: Unknown; ComponentLink1URL: http://www.farnell.com/datasheets/1880164.pdf; ComponentLink1Description: http://www.farnell.com/datasheets/1880164.pdf; ComponentLink2URL: http://katalog.we-online.de/pbs/datasheet/865080545012.pdf; ComponentLink2Description: http://katalog.we-online.de/pbs/datasheet/865080545012.pdf; Supplier Part Number 1: 732-8511-6-ND
C9 C41 C42 C58 = CMP-1035-02593-1: as C13 on sheet node24-bank; Max Thickness: 1 mm; Value: 100nF; Technology: SMT; Rated Voltage: 50 V
C38 = CMP-1035-02734-1: CAP 1uF 10V ±20% 0603 (1608 Metric) Thickness 1mm SMD; Tolerance: Â±20%; Case-EIA: 0603; Case-Metric: 1608; Technology: SMT; Value: 1uF; Max Thickness: 1 mm; Rated Voltage: 10 V
C39 = CMP-1035-02322-1: CAP 10nF 50V ±20% 0603 (1608 Metric) Thickness 1mm SMD; Case-Metric: 1608; Tolerance: Â±20%; Case-EIA: 0603; Rated Voltage: 50 V; Value: 10nF; Max Thickness: 1 mm; Technology: SMT
D1 D2 = TVS_24V_QUAD_300W_SOT23-6_ESDA25SC6Y: TVS DIODE 24VWM 30VC SOT23; Manufacturer: STMicroelectronics; Direction: Unidirectional; Capacitance: 60pF; Max Surge Current: 7A; Clamping Voltage: 30V; Number of Unidirectional Channels: 4; Min Breakdown Voltage: 25V; Power Line Protection: No; Leakage Current: 1uA; Peak Pulse Current: 10A; Supplier 1: Digi-Key; Stock 1: 18642; Pricing 1: 1=0.52, 10=0.419, 100=0.2855, 500=0.21414, 1000=0.16061 (USD); Mount: Surface Mount; Case/Package: SOT-23-6; Number of Pins: 6; Min Operating Temperature: -40°C; Max Operating Temperature: 150°C; Working Voltage: 24V; Packaging: Tape and Reel; Package Quantity: 1; Polarity: Unidirectional; Termination: SMD/SMT; Reverse Standoff Voltage: 24V; Length: 3mm; Height: 3mm; Depth: 1.75mm; Radiation Hardening: No; Lead Free: Lead Free; ComponentLink1URL: https://datasheet.ciiva.com/12326/dm00035423-211710-12326640.pdf; ComponentLink1Description: https://datasheet.ciiva.com/12326/dm00035423-211710-12326640.pdf; ComponentLink2URL: https://datasheet.ciiva.com/6577/dm00035423-6577883.pdf; ComponentLink2Description: https://datasheet.ciiva.com/6577/dm00035423-6577883.pdf; ComponentLink3URL: https://datasheet.ciiva.com/6577/dm00035423-6577884.pdf; ComponentLink3Description: https://datasheet.ciiva.com/6577/dm00035423-6577884.pdf; ComponentLink4URL: https://datasheet.ciiva.com/6577/dm00035423-6577885.pdf; ComponentLink4Description: https://datasheet.ciiva.com/6577/dm00035423-6577885.pdf; ComponentLink5URL: https://datasheet.ciiva.com/25958/dm00035423-25958158.pdf; ComponentLink5Description: https://datasheet.ciiva.com/25958/dm00035423-25958158.pdf; ComponentLink6URL: https://datasheet.ciiva.com/41443/001184002-da-01-en-tvs-diode-24v-300w-esda25sc6y-sot-23-stm-41443447.pdf; ComponentLink6Description: https://datasheet.ciiva.com/41443/001184002-da-01-en-tvs-diode-24v-300w-esda25sc6y-sot-23-stm-41443447.pdf; Supplier Part Number 1: 497-13421-6-ND; Breakdown Voltage: 25V
D6 = TVS_5V_DUAL_SOT23-3_SM05-7: TVS DIODE 5VWM 20.6VC SOT23; Manufacturer: Diodes; Direction: Unidirectional,Bidirectional; Element Configuration: Common Anode; Capacitance: 230pF; Number of Unidirectional Channels: 2; Clamping Voltage: 20.6V; Power Line Protection: No; Polarity: Unidirectional; Breakdown Voltage: 7.3V; Leakage Current: 10uA; ESD Protection: Yes; Test Current: 1mA; Peak Pulse Current: 17A; Min Breakdown Voltage: 6.2V; Supplier 1: Digi-Key; Stock 1: 20844; Pricing 1: 1=0.46, 10=0.341, 100=0.1932, 500=0.12792, 1000=0.09808 (USD); Mount: Surface Mount; Case/Package: SOT-23; Number of Pins: 3; Contact Plating: Tin,Matte; Min Operating Temperature: -55°C; Max Operating Temperature: 150°C; Package Quantity: 3000; Packaging: Tape and Reel; Peak Pulse Power: 300W; Termination: SMD/SMT; Working Voltage: 5V; Max Reverse Leakage Current: 10uA; Length: 2.9mm; Height: 1mm; Width: 1.3mm; Depth: 1.3mm; Radiation Hardening: No; Lead Free: Lead Free; ComponentLink1URL: https://datasheet.ciiva.com/333/ds31828-333314.pdf; ComponentLink1Description: https://datasheet.ciiva.com/333/ds31828-333314.pdf; ComponentLink2URL: https://datasheet.ciiva.com/15186/getdatasheetpartid-375729-15186470.pdf; ComponentLink2Description: https://datasheet.ciiva.com/15186/getdatasheetpartid-375729-15186470.pdf; ComponentLink3URL: https://datasheet.ciiva.com/25956/ds31828-25956699.pdf; ComponentLink3Description: https://datasheet.ciiva.com/25956/ds31828-25956699.pdf; ComponentLink4URL: https://datasheet.ciiva.com/13083/ds31828-89171-13083151.pdf; ComponentLink4Description: https://datasheet.ciiva.com/13083/ds31828-89171-13083151.pdf; Supplier Part Number 1: SM05-7DIDKR-ND
F1 = FUSE_BELFUSE_PTC_30V_500MA_1812_0ZCG0050AF2C: PTC RESETTABLE 30V 500MA 1812; Manufacturer: Bel; Max Current Rating: 100A; Trip Current: 1A; Supplier 1: Digi-Key; Stock 1: 278574; Pricing 1: 1=0.14, 5=0.134, 10=0.129, 50=0.1148, 100=0.1069, 250=0.09504, 500=0.0792, 1000=0.07524 (USD); Mount: Surface Mount; Case/Package: 1812; Case Code (Metric): 4532; Case Code (Imperial): 1812; Contact Plating: Tin,Matte; Min Operating Temperature: -40°C; Max Operating Temperature: 85°C; Package Quantity: 1; Packaging: Tape and Reel; Lead Free: Lead Free; ComponentLink1URL: https://datasheet.ciiva.com/18550/0zcg-18550748.pdf; ComponentLink1Description: https://datasheet.ciiva.com/18550/0zcg-18550748.pdf; ComponentLink2URL: https://datasheet.ciiva.com/18550/0zcg-18550749.pdf; ComponentLink2Description: https://datasheet.ciiva.com/18550/0zcg-18550749.pdf; ComponentLink3URL: https://datasheet.ciiva.com/18550/0zcg-18550750.pdf; ComponentLink3Description: https://datasheet.ciiva.com/18550/0zcg-18550750.pdf; Supplier Part Number 1: 507-1762-6-ND
J1 = CONN_ASSMANN_JACK_MOD_4P4C_A-2014-3-4-N-T-R: CONN MOD JACK 4P4C VERT; Shielding: Unshielded; Max Current Rating: 1.5A; Contact Resistance: 20mR; Number of Ports: 1; Number of Positions Loaded: 4; Max Voltage Rating (AC): 120V; Direction: User Selectable; Pitch: 2.54mm; Supplier 1: Digi-Key; Manufacturer: Assmann; Stock 1: 29088; Pricing 1: 1=0.55, 10=0.516, 25=0.4644, 50=0.4128, 100=0.3956, 250=0.3612, 500=0.344, 1000=0.2838, 2500=0.258 (USD); Mount: Through Hole; Contact Material: Bronze; Contact Plating: Nickel,Gold; Housing Colour: Black; Housing Material: Glass; Min Operating Temperature: -40°C; Max Operating Temperature: 85°C; Package Quantity: 130; Number of Rows: 1; Packaging: Tray; Termination: Solder; Orientation: Vertical; Connector Type: Jack; Length: 11.43mm; Depth: 16.5mm; Lead Free: Lead Free; ComponentLink1URL: http://components.arrow.com/part/dataview/0323_07027207; ComponentLink1Description: http://components.arrow.com/part/dataview/0323_07027207; ComponentLink2URL: http://www.assmann-wsw.com/fileadmin/datasheets/ASS_7331_CO.PDF; ComponentLink2Description: http://www.assmann-wsw.com/fileadmin/datasheets/ASS_7331_CO.PDF; ComponentLink3URL: http://www.assmann.us/specs/A-2014-3-4-N-T-R.pdf; ComponentLink3Description: http://www.assmann.us/specs/A-2014-3-4-N-T-R.pdf; Supplier Part Number 1: AE10393-ND
J3 = CONN_HDR_1X4_2MM4_76384-404LF: Manufacturer: Amphenol FCI; Number of Contacts: 4; Current Rating: 3A; Voltage Rating: 1kV; Connector Type: Male Pin; Gender: Male; Pitch: 2.54mm; Mating Post Length: 5mm; Supplier 1: Digi-Key; Stock 1: 1255; Pricing 1: 1=0.65, 10=0.611, 100=0.4687, 500=0.4076, 1000=0.33627, 5000=0.29551, 10000=0.27513 (USD); Mount: Through Hole; Contact Plating: Nickel,Tin,Gold; Colour: Black; Contact Material: Bronze,Copper Alloy; Housing Colour: Black; Housing Material: Thermoplastic; Min Operating Temperature: -40°C; Max Operating Temperature: 125°C; Number of Rows: 1; Termination: Solder; Package Quantity: 500; Packaging: Bulk; Number of Positions: 4; Max Voltage Rating (AC): 1kV; Orientation: Straight; Fastening Type: Friction; Length: 9.16mm; Contact Mating Length: 0.197inch; Termination Post Length: 3.4mm; Width: 4.7mm; Depth: 5mm; Radiation Hardening: No; Lead Free: Lead Free; ComponentLink1URL: https://datasheet.ciiva.com/713/76384-713329.pdf; ComponentLink1Description: https://datasheet.ciiva.com/713/76384-713329.pdf; ComponentLink2URL: https://datasheet.ciiva.com/16689/76384-16689063.pdf; ComponentLink2Description: https://datasheet.ciiva.com/16689/76384-16689063.pdf; ComponentLink3URL: https://datasheet.ciiva.com/9473/76384-9473260.pdf; ComponentLink3Description: https://datasheet.ciiva.com/9473/76384-9473260.pdf; Supplier Part Number 1: 609-1319-ND
R20 = CMP-1012-00849-1: 1M 0.1W 1% 0603 (1608 Metric)  SMD; Value: 1000000.00 Ohm; Case-EIA: 0603; Case-Metric: 1608; Power: 0.1 W; Tolerance: 1 %; Technology: SMT
R21 R22 = CMP-1012-00623-1: as R16 on sheet node24-bank; Power: 0.1 W; Tolerance: 1 %; Technology: SMT
R23 R24 = RES_2010_0R25_1W_CSRN2010FKR250: Res Thick Film 2010 0.25 Ohm 1% 1W ±250ppm/C Molded SMD Plastic T/R; Manufacturer: Stackpole Electronics; Temperature Coefficient: 250ppm/°C; Supplier 1: Digi-Key; Manufacturer Part Number: CSRN2010FKR250; Stock 1: 10883; Pricing 1: 1=0.65, 10=0.462, 25=0.3604, 50=0.305, 100=0.2402, 250=0.20328, 500=0.16632 (USD); Mount: Surface Mount; Case/Package: 2010; Case Code (Metric): 5025; Contact Plating: Tin,Matte; Min Operating Temperature: -55°C; Max Operating Temperature: 155°C; Packaging: Tape and Reel; Tolerance: 1%; Composition: Thick Film; Number of Terminations: 2; Military Standard: Not; Max Power Dissipation: 1W; Length: 0.197inch; Height: 0.03inch; Width: 0.097inch; Depth: 2.54mm; Radiation Hardening: No; Lead Free: Lead Free; ComponentLink1URL: https://datasheet.ciiva.com/26835/getdatasheetpartid-747701-26835495.pdf; ComponentLink1Description: https://datasheet.ciiva.com/26835/getdatasheetpartid-747701-26835495.pdf; Supplier Part Number 1: CSRN2010FKR250DKR-ND
TP8 TP9 TP14 = TEST_POINT: TEST_PAD_NO_PART; Manufacturer Part Number: None -- copper test pad
U3 = IC_PMIC_TI_DRV8825PWPR: IC MOTOR DRIVER PAR 28HTSSOP; Manufacturer: Texas Instruments; Output Current: 2.5A; Max Supply Voltage: 45V; Min Supply Voltage: 8V; Logic Function: AND; Supplier 1: Digi-Key; Stock 1: 66105; Pricing 1: 1=3.84, 10=3.452, 100=2.828, 500=2.4074, 1000=2.03034 (USD); Mount: Surface Mount; Case/Package: HTSSOP EP; Number of Pins: 28; Min Operating Temperature: -40°C; Max Operating Temperature: 85°C; Type: Integrated Circuit (IC); Packaging: Tape and Reel; Package Quantity: 1; Radiation Hardening: No; Lead Free: Lead Free; ComponentLink1URL: https://datasheet.ciiva.com/26086/drv8825-26086085.pdf; ComponentLink1Description: https://datasheet.ciiva.com/26086/drv8825-26086085.pdf; ComponentLink2URL: https://datasheet.ciiva.com/3229/drv8825-3229031.pdf; ComponentLink2Description: https://datasheet.ciiva.com/3229/drv8825-3229031.pdf; ComponentLink3URL: https://datasheet.ciiva.com/26810/getdatasheetpartid-625248-26810663.pdf; ComponentLink3Description: https://datasheet.ciiva.com/26810/getdatasheetpartid-625248-26810663.pdf; ComponentLink4URL: https://datasheet.ciiva.com/1959/drv8825-1959819.pdf; ComponentLink4Description: https://datasheet.ciiva.com/1959/drv8825-1959819.pdf; ComponentLink5URL: https://datasheet.ciiva.com/1959/drv8825-1959820.pdf; ComponentLink5Description: https://datasheet.ciiva.com/1959/drv8825-1959820.pdf; ComponentLink6URL: https://datasheet.ciiva.com/1959/drv8825-1959821.pdf; ComponentLink6Description: https://datasheet.ciiva.com/1959/drv8825-1959821.pdf; Supplier Part Number 1: 296-29503-6-ND; Nominal Supply Current: 2.5A; Manufacturer Part Number: DRV8825PWPR